# EAGLE design ENC11LED (EAGLE 7.2.0)
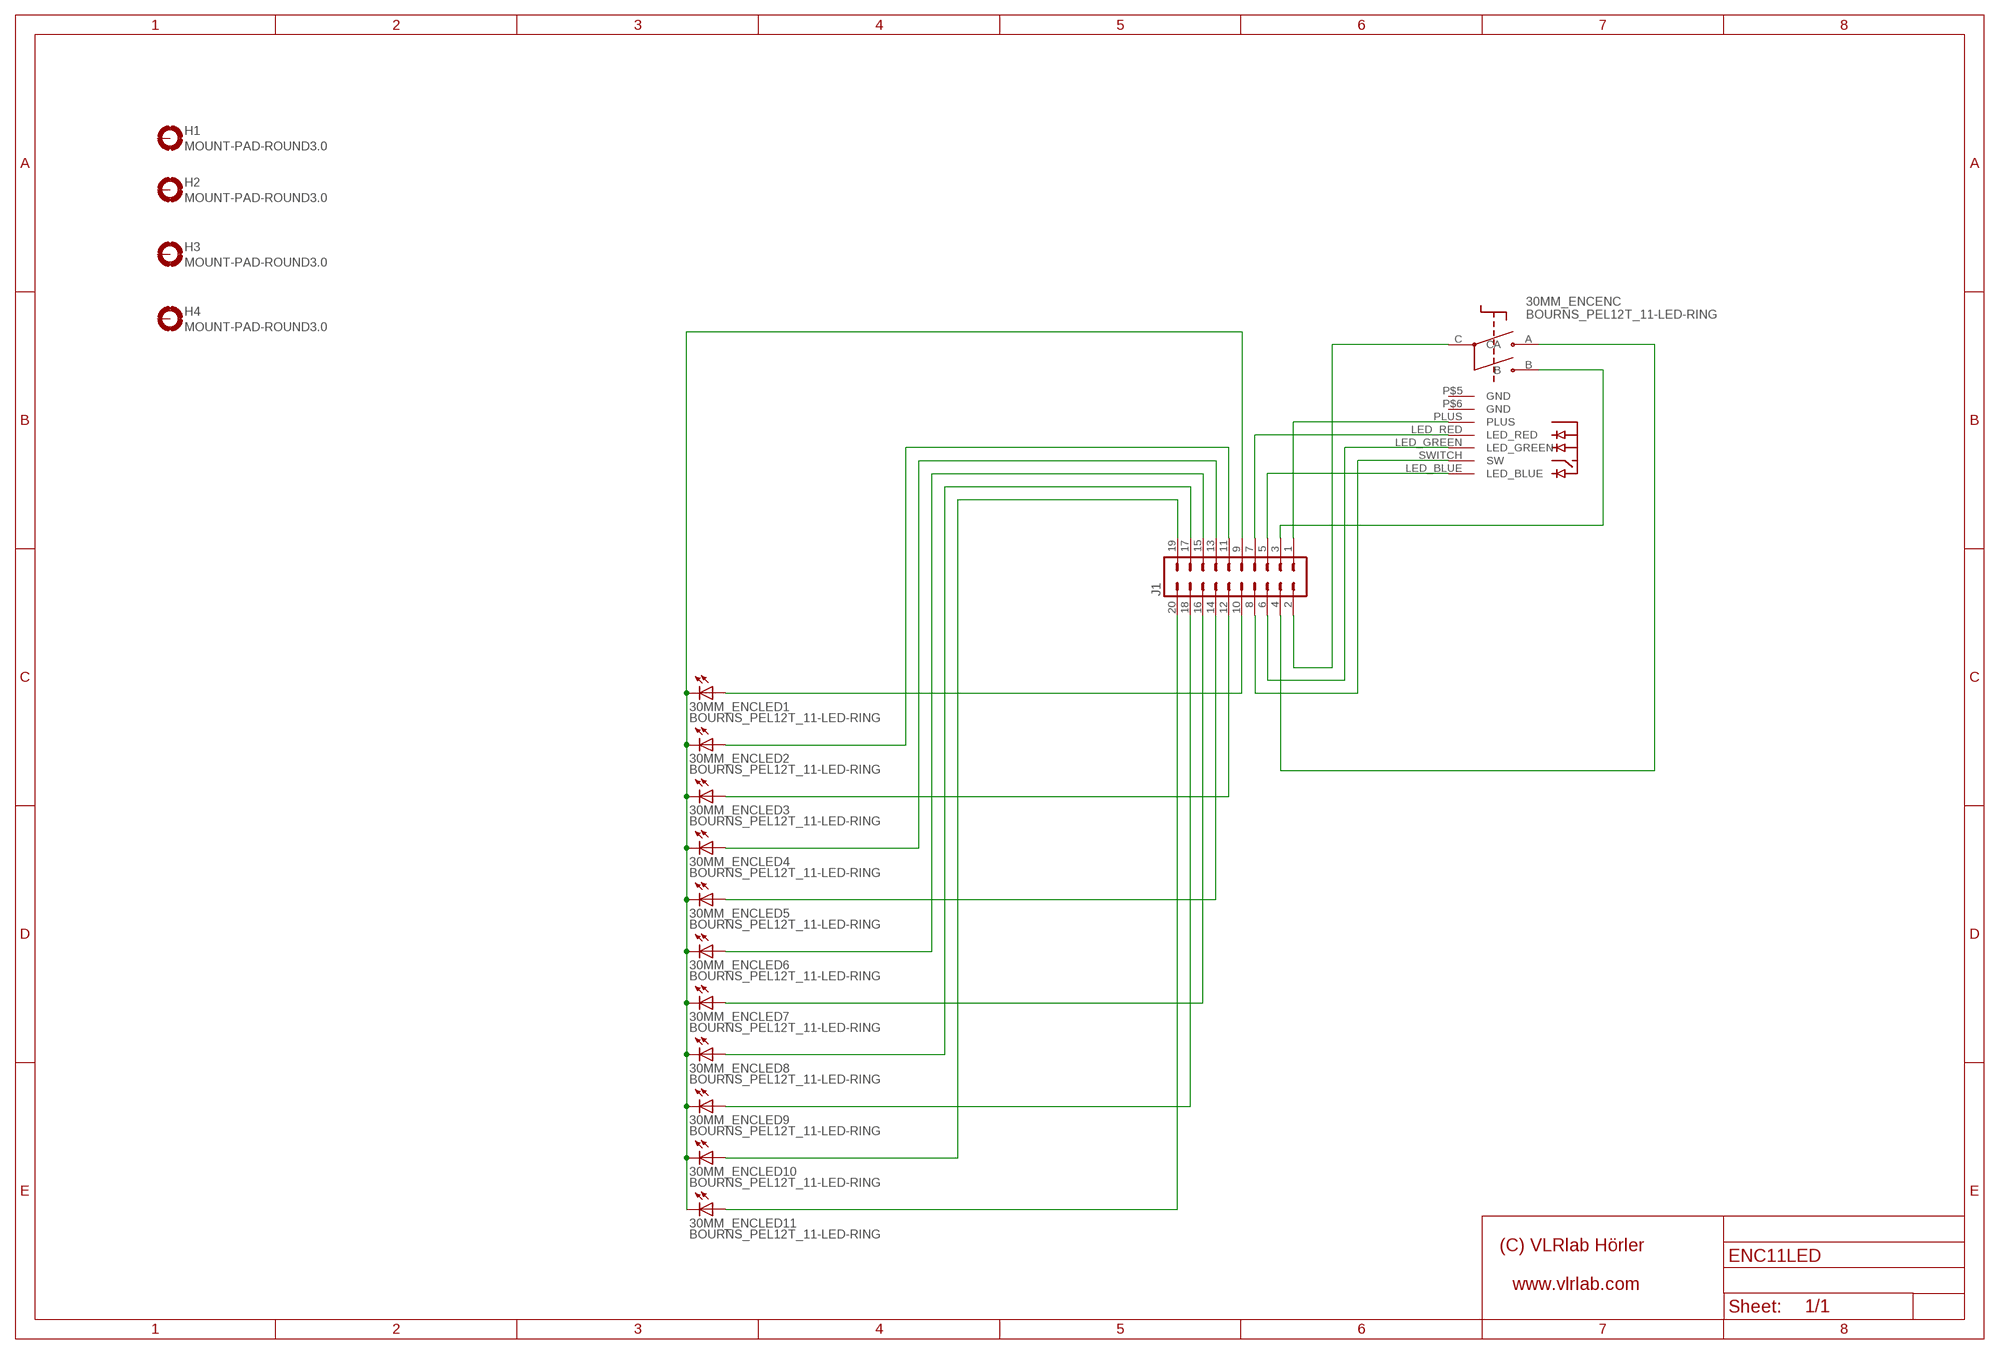
[diagram p0: schematic, sheet 1]

## Parts
30MM_ENC  BOURNS_PEL12T_11-LED-RING  [PEL12T_11-LED-RING]
H1  MOUNT-PAD-ROUND3.0  [3,0-PAD]
H2  MOUNT-PAD-ROUND3.0  [3,0-PAD]
H3  MOUNT-PAD-ROUND3.0  [3,0-PAD]
H4  MOUNT-PAD-ROUND3.0  [3,0-PAD]
J1  ML20  [ML20]

## Nets
+: 30MM_ENC.PLUS(ENC:PLUS) J1.1
A: 30MM_ENC.A(ENC:A) J1.4
B: 30MM_ENC.B(ENC:B) J1.3
BLUE: 30MM_ENC.LED_BLUE(ENC:LED_BLUE) J1.5
GREEN: 30MM_ENC.LED_GREEN(ENC:LED_GREEN) J1.6
LED1: 30MM_ENC.A1(LED1:A) J1.10
LED2: 30MM_ENC.A2(LED2:A) J1.11
LED3: 30MM_ENC.A3(LED3:A) J1.12
LED4: 30MM_ENC.A4(LED4:A) J1.13
LED5: 30MM_ENC.A5(LED5:A) J1.14
LED6: 30MM_ENC.A6(LED6:A) J1.15
LED7: 30MM_ENC.A7(LED7:A) J1.16
LED8: 30MM_ENC.A8(LED8:A) J1.17
LED9: 30MM_ENC.A9(LED9:A) J1.18
LED10: 30MM_ENC.A10(LED10:A) J1.19
LED11: 30MM_ENC.A12(LED11:A) J1.20
LED_ROW: 30MM_ENC.K1(LED1:C) 30MM_ENC.K2(LED2:C) 30MM_ENC.K3(LED3:C) 30MM_ENC.K4(LED4:C) 30MM_ENC.K5(LED5:C) 30MM_ENC.K6(LED6:C) 30MM_ENC.K7(LED7:C) 30MM_ENC.K8(LED8:C) 30MM_ENC.K9(LED9:C) 30MM_ENC.K10(LED10:C) 30MM_ENC.K12(LED11:C) J1.9
N$2: 30MM_ENC.C(ENC:C) J1.2
RED: 30MM_ENC.LED_RED(ENC:LED_RED) J1.7
SW: 30MM_ENC.SWITCH(ENC:SW) J1.8
Unconnected: 30MM_ENC.P$5(ENC:GND) 30MM_ENC.P$6(ENC:GND) H1.B3,0(MOUNT) H2.B3,0(MOUNT) H3.B3,0(MOUNT) H4.B3,0(MOUNT)

## Library data of the parts
30MM_ENC = Bourns Encoder:BOURNS_PEL12T_11-LED-RING
H1-H4 = holes:MOUNT-PAD-ROUND: MOUNTING PAD, round
J1 = con-ml:ML20: HARTING; OC_FARNELL: unknown; OC_NEWARK: unknown

## Net classes
0 default: width 0.254 mm, drill 0.33 mm, clearance 0.254 mm
1 VDD: width 0.813 mm, drill 0.33 mm, clearance 0.254 mm to class 0, clearance 0.254 mm
2 10V: width 1.016 mm, drill 0.33 mm, clearance 0.254 mm to class 0, clearance 0.254 mm to class 1, clearance 0.254 mm

## Board
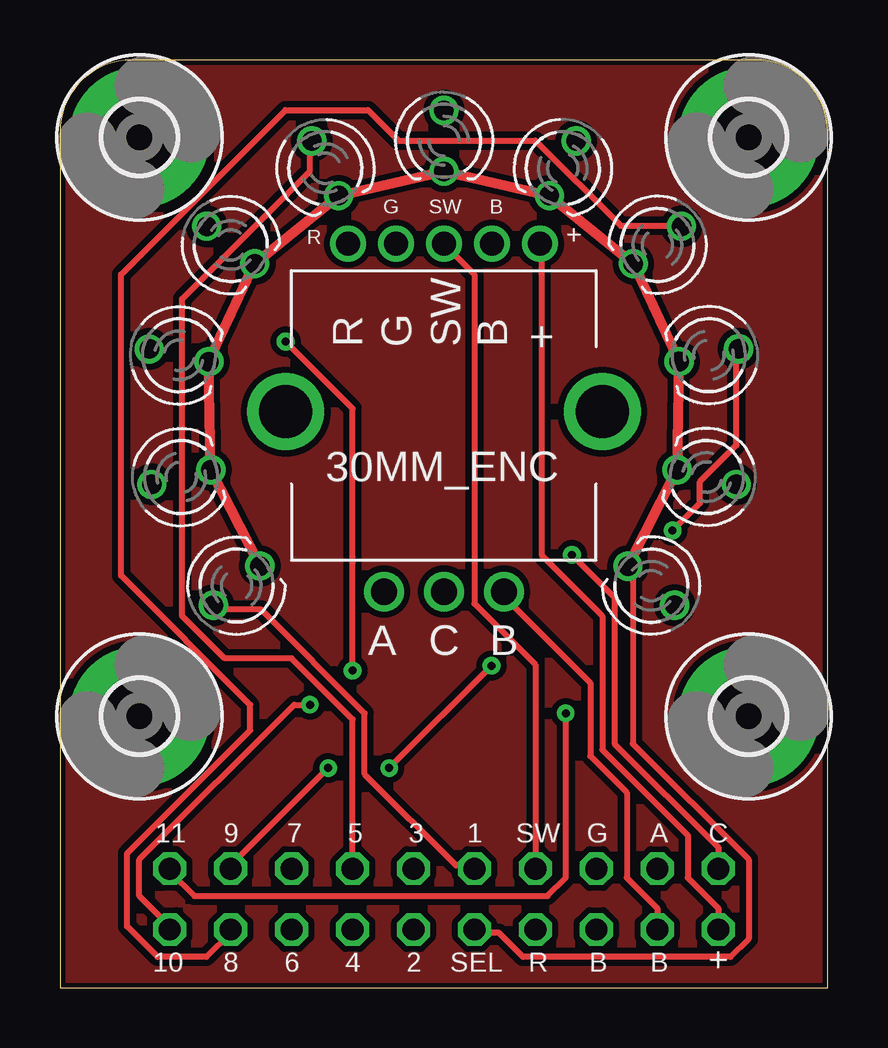
[diagram p1: board, top side]
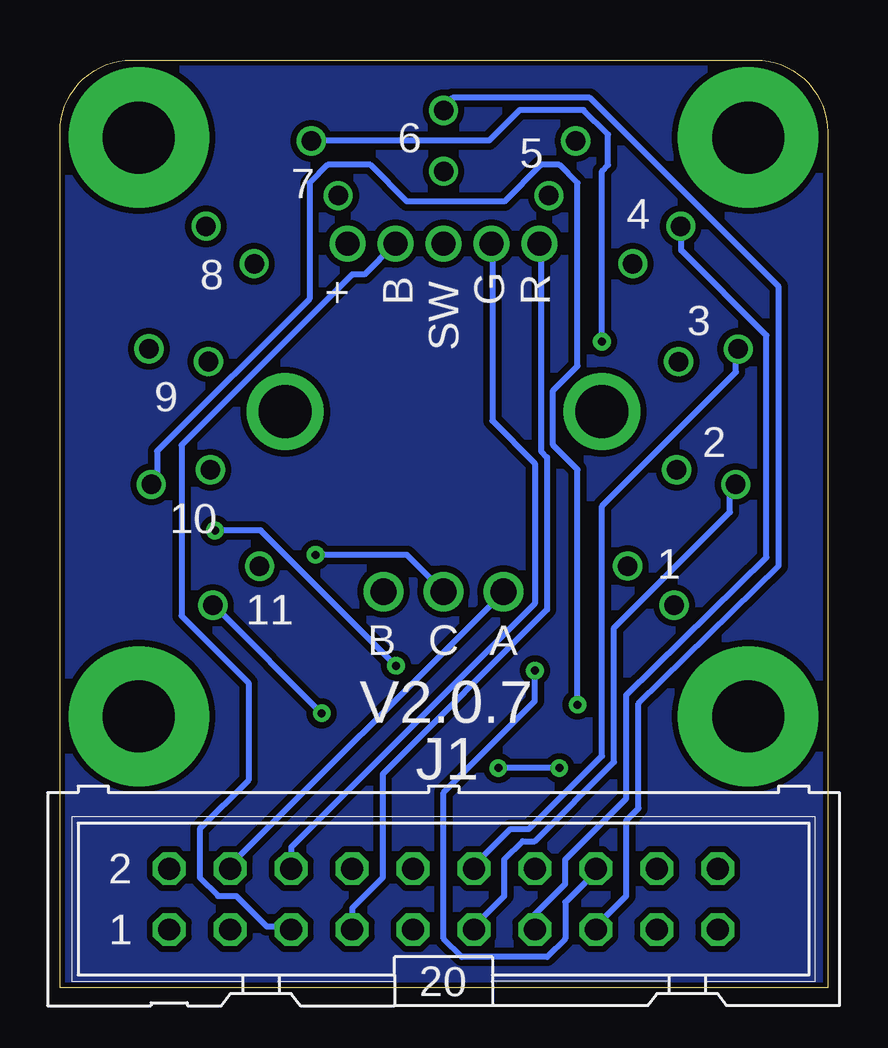
[diagram p2: board, bottom side, seen from below]

Size 32 x 38.67 mm. Coordinates in mm from the lower left corner, seen from the top.
Outline: 0,0 32,0 32,35.67 arc90 29,38.67 3,38.67 arc90 0,35.67 0,0
Copper layers (1*16): Top 0.07mm / dielectric 1.86mm / Bottom 0.07mm
Design rules "001_MakePCB-8mil_min *": minimum track width 8mil, minimum drill 13mil, track to track 8mil, track to pad 8mil, pad to pad 8mil, via to via 8mil, smd to smd 8mil, copper to edge 8mil, drill to drill 8mil, minimum pad ring 8mil, minimum via ring 8mil, stop-mask expansion 4mil, vias tented up to drill 14mil, thermal gap 10mil

### Footprints (pad centres in the part's own frame; a part is rotated, then mirrored left to right if it is on the bottom)
PEL12T_11-LED-RING = drill 1.1: A -2.5,-7.5; B 2.5,-7.5; C 0,-7.5 | drill 0.813: A1 -9.619,-8.067; A2 -12.186,-3.035; A3 -12.289,2.612; A4 -9.894,7.73; A5 -5.505,11.287; A6 0,12.56; A7 5.508,11.288; A8 9.897,7.732; A9 12.282,2.615; A10 12.183,-3.034; A12 9.614,-8.072; K1 -7.673,-6.434; K2 -9.721,-2.42; K3 -9.804,2.084; K4 -7.893,6.166; K5 -4.392,9.004; K6 0,10.02; K7 4.394,9.005; K8 7.896,6.168; K9 9.798,2.087; K10 9.719,-2.42; K12 7.668,-6.439 | drill 1: LED_BLUE 2,7; LED_GREEN -2,7; LED_RED -4,7; PLUS 4,7; SWITCH 0,7 | drill 2.2: P$5 6.6,0; P$6 -6.6,0
3,0-PAD = drill 3 pad 5.842: B3,0 0,0
ML20 = drill 0.914 octagon: 1 -11.43,-1.27; 2 -11.43,1.27; 3 -8.89,-1.27; 4 -8.89,1.27; 5 -6.35,-1.27; 6 -6.35,1.27; 7 -3.81,-1.27; 8 -3.81,1.27; 9 -1.27,-1.27; 10 -1.27,1.27; 11 1.27,-1.27; 12 1.27,1.27; 13 3.81,-1.27; 14 3.81,1.27; 15 6.35,-1.27; 16 6.35,1.27; 17 8.89,-1.27; 18 8.89,1.27; 19 11.43,-1.27; 20 11.43,1.27

### Placement (x,y rotation side)
30MM_ENC  16.01,24.02 0 top
H1  28.71,35.45 0 top
H2  3.31,35.45 0 top
H3  28.71,11.31 0 top
H4  3.31,11.31 0 top
J1  16.01,3.7 0 bottom
U$1  [VLRLAB_SMAL]  30.89,17.74 90 top
U$2  [VLRLAB_SMAL]  30.39,17.54 90 bottom

### Tracks (layer width: path | path; a pad name or v marks a point on that pad's centre or on a via)
+
  Top 0.254: J1.1 27.44,3.31 26.17,4.58 26.17,6.36 22.61,9.92 22.61,15.51 20.07,18.05 20.07,31 30MM_ENC.PLUS
A
  Bottom 0.254: J1.4 24.9,5.09 13.98,16.01 13.72,16.01 13.47,16.27 30MM_ENC.A
B
  Top 0.254: J1.3 24.9,3.31 23.63,4.58 23.63,8.14 22.11,9.66 22.11,12.71 18.55,16.27 30MM_ENC.B
BLUE
  Bottom 0.254: J1.5 22.36,2.55 23.38,2.55 24.65,3.82 25.41,3.82 26.17,4.58 26.17,6.62 24.14,8.65 24.14,12.71 26.93,15.51 26.93,22.62 19.82,29.73 19.31,29.73 18.04,31 30MM_ENC.LED_BLUE
GND
  pour Top: 0.14,-0.11 0.14,35.62 arc-90 3.13,38.62 28.89,38.62 arc-90 31.88,35.62 31.88,-0.11
  pour Bottom: 0.14,-0.11 0.14,35.62 arc-90 3.13,38.62 28.89,38.62 arc-90 31.88,35.62 31.88,-0.11
GREEN
  Bottom 0.254: J1.6 22.36,5.85 12.2,16.01 12.2,21.86 13.98,23.63 13.98,31 30MM_ENC.LED_GREEN
LED1
  Top 0.254: 30MM_ENC.A1 6.61,15.76 8.39,15.76 12.71,11.44 12.71,8.9 16.52,5.09 17.28,5.09 J1.10
LED2
  Bottom 0.254: 30MM_ENC.A2 4.07,20.84 4.07,19.82 8.9,15 8.9,9.41 12.2,6.11 12.71,6.11 13.47,5.35 13.47,3.82 14.74,2.55 J1.11
LED3
  Bottom 0.254: 30MM_ENC.A3 3.82,26.43 3.82,25.67 9.41,20.08 9.41,9.66 12.45,6.62 13.22,6.62 14.74,5.09 J1.12
LED4
  Bottom 0.254: J1.13 12.2,3.06 10.93,4.33 10.93,5.35 8.39,7.89 8.39,12.2 2.55,17.94 2.55,27.19 6.1,30.75 6.1,31.51 30MM_ENC.A4
LED5
  Top 0.254: J1.14 12.2,11.19 9.66,13.73 6.87,13.73 5.09,15.51 5.09,28.71 10.42,34.05 10.42,35.06 30MM_ENC.A5
LED6
  Bottom 0.254: 30MM_ENC.A6 16.14,36.59 15.63,37.1 9.91,37.1 2.04,29.22 2.04,17.59 7.88,11.85 7.88,7.48 8.39,6.97 8.39,3.82 9.66,2.55 J1.15
LED7  (via drill 0.33)
  Top 0.254: v9.41,26.94 12.2,24.14 v12.2,13.22
  Bottom 0.254: v9.41,26.94 9.41,34.05 9.15,34.3 9.15,35.57 10.17,36.59 12.84,36.59 14.11,35.32 21.34,35.32 30MM_ENC.A7 | v12.2,13.22 12.2,11.95 16.01,8.14 16.01,2.04 15.25,1.28 11.69,1.28 10.93,2.04 10.93,3.57 9.66,4.84 J1.16
LED8
  Top 0.254: 30MM_ENC.A8 25.66,31.76 23.38,31.76 19.82,35.32 14.11,35.32 12.84,36.59 9.41,36.59 2.55,29.73 2.55,17.18 7.93,11.8 7.93,10.73 2.8,5.6 2.8,2.55 4.07,1.28 6.1,1.28 7.12,2.3 J1.17
LED9  (via drill 0.33)
  Top 0.254: v25.54,19.06 26.68,20.2 26.68,21.09 28.2,22.62 28.2,26.43 30MM_ENC.A9 | v13.72,9.16 v17.99,13.42 | v11.18,9.16 7.12,5.09 J1.18
  Bottom 0.254: v25.54,19.06 23.63,19.06 v17.99,13.42 | v11.18,9.16 v13.72,9.16
LED10  (via drill 0.33)
  Top 0.254: v10.42,11.8 9.76,11.8 3.31,5.35 3.31,3.82 4.58,2.55 J1.19
  Bottom 0.254: v10.42,11.8 10.42,21.6 11.44,22.62 11.44,24.9 10.42,25.92 10.42,33.54 11.18,34.3 11.95,34.3 13.47,32.78 17.53,32.78 19.06,34.3 20.84,34.3 21.6,33.54 21.6,28.71 27.95,22.36 27.95,21.09 30MM_ENC.A10
LED11  (via drill 0.33)
  Top 0.254: v21.09,11.44 21.09,4.58 20.33,3.82 5.6,3.82 4.58,4.84 J1.20
  Bottom 0.254: v21.09,11.44 25.41,15.76 30MM_ENC.A12
LED_ROW
  Top 0.254: J1.9 17.28,2.3 18.3,2.3 19.31,1.28 27.95,1.28 28.71,2.04 28.71,5.35 23.88,10.17 23.88,17.54 30MM_ENC.K12
  Top 0.406: 30MM_ENC.K1 30MM_ENC.K2 30MM_ENC.K3 30MM_ENC.K4 30MM_ENC.K5 30MM_ENC.K6 30MM_ENC.K7 30MM_ENC.K8 30MM_ENC.K9 30MM_ENC.K10 30MM_ENC.K12
N$2  (via drill 0.33)
  Top 0.254: J1.2 27.44,5.85 23.12,10.17 23.12,16.27 v21.34,18.05
  Bottom 0.254: v21.34,18.05 17.53,18.05 30MM_ENC.C
RED
  Bottom 0.254: J1.7 19.82,3.31 18.55,4.58 18.55,8.9 11.69,15.76 11.69,22.11 11.95,22.36 11.95,31 30MM_ENC.LED_RED
SW
  Top 0.254: J1.8 19.82,13.47 17.28,16.01 17.28,29.73 16.01,31 30MM_ENC.SWITCH

### Text on the board
tNames: G | SW | B | R | + | A | C | B | 11 | 9 | 7 | 5 | 3 | 1 | SW | G | A | C | 10 | 8 | 6 | 4 | 2 | SEL | R | B | B | +
bNames: 6 | 5 | 7 | 4 | 8 | R | G | B | + | 3 | SW | 9 | 2 | 10 | 1 | 11 | A | C | B | V2.0.7